# Altium schematic sheet FPGA_MIO.SchDoc: TE0723 - FPGA MIO
size A4; PageSetup: Record=PageOptions|CenterHorizontal=True|CenterVertical=True|PrintScale=0.96|XCorrection=1.00|YCorrection=1.00|PrintKind=0|BorderSize=5000000|LeftOffset=0|BottomOffset=0|Orientation=2|PaperLength=1000|PaperWidth=1000|Scale=100|PaperSource=7|PrintQuality=-4|MediaType=1|DitherType=10|PaperKind=A4|PrintScaleMode=1; Organization: Trenz Electronic GmbH; DocumentNumber: TE0723; Revision: 01; SheetNumber: 4; SheetTotal: 12; Date: 08.07.2015; Author: Indrek Tubalkain; CompanyName: Trenz Electronic GmbH; DrawnBy: Indrek Tubalkain; Engineer: Indrek Tubalkain; ProjectName: TE0723 Arduino
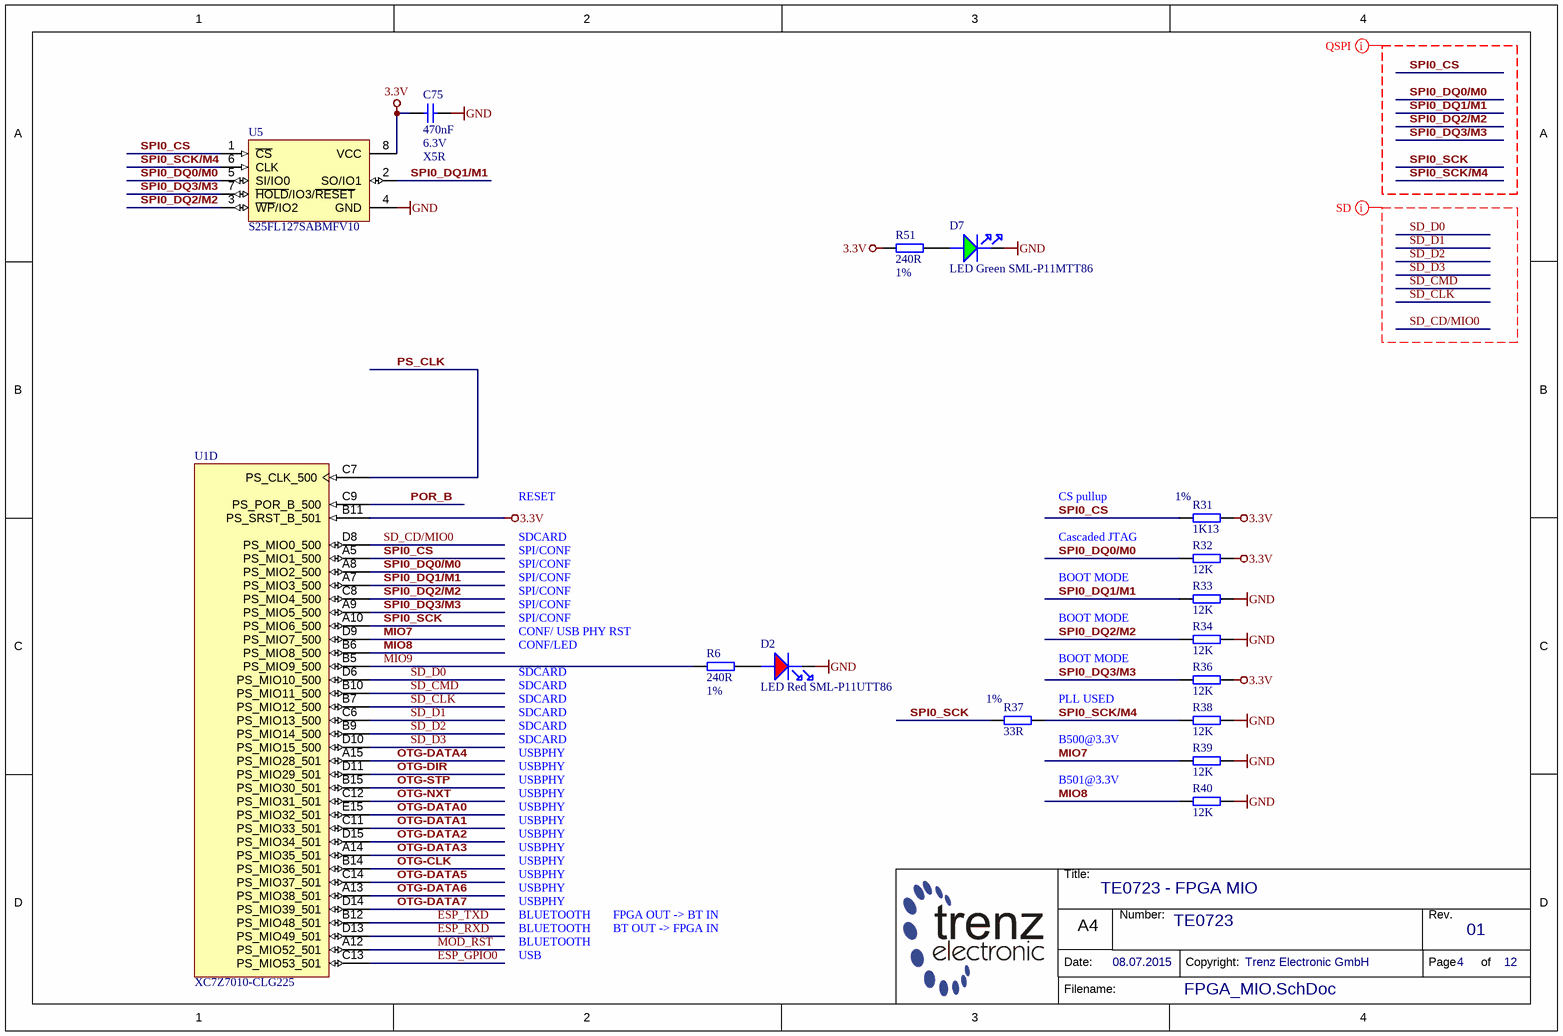
[diagram p0: FPGA_MIO.SchDoc]

## Parts
C75  470nF  Voltage: 6.3V  Technology: X5R  [CAPC0603X33N]
D2  LED Red SML-P11UTT86  [LEDC1006X25N_RED]
D7  LED Green SML-P11MTT86  [LEDC1006X25N_GREEN]
R6  240R  Tolerance: 1%  [RESC1005X40N]
R31  1K13  Tolerance: 1%  [RESC1005X40N]
R32  12K  [RESC1005X40N]
R33  12K  [RESC1005X40N]
R34  12K  [RESC1005X40N]
R36  12K  [RESC1005X40N]
R37  33R  Tolerance: 1%  [RESC0603X26N]
R38  12K  [RESC1005X40N]
R39  12K  [RESC1005X40N]
R40  12K  [RESC1005X40N]
R51  240R  Tolerance: 1%  [RESC1005X40N]
U1  XC7Z7010-CLG225  (part D of 8)
U5  S25FL127SABMFV10  [SOIC127P790X216-8N]

## Nets
3.3V: C75.1 R31.2 R32.2 R36.2 R51.2 U1.B11(PS_SRST_B_501) U5.8(VCC)
GND: C75.2 D2.K D7.K R33.2 R34.2 R38.2 R39.2 R40.2 U5.4(GND)
ESP_GPIO0: U1.C13(PS_MIO53_501)
ESP_RXD: U1.D13(PS_MIO49_501)
ESP_TXD: U1.B12(PS_MIO48_501)
MIO7: R39.1 U1.D9(PS_MIO7_500)
MIO8: R40.1 U1.B6(PS_MIO8_500)
MIO9: R6.2 U1.B5(PS_MIO9_500)
MOD_RST: U1.A12(PS_MIO52_501)
OTG-CLK: U1.B14(PS_MIO36_501)
OTG-DATA0: U1.E15(PS_MIO32_501)
OTG-DATA1: U1.C11(PS_MIO33_501)
OTG-DATA2: U1.D15(PS_MIO34_501)
OTG-DATA3: U1.A14(PS_MIO35_501)
OTG-DATA4: U1.A15(PS_MIO28_501)
OTG-DATA5: U1.C14(PS_MIO37_501)
OTG-DATA6: U1.A13(PS_MIO38_501)
OTG-DATA7: U1.D14(PS_MIO39_501)
OTG-DIR: U1.D11(PS_MIO29_501)
OTG-NXT: U1.C12(PS_MIO31_501)
OTG-STP: U1.B15(PS_MIO30_501)
POR_B: U1.C9(PS_POR_B_500)
PS_CLK: U1.C7(PS_CLK_500)
SD_CD/MIO0: U1.D8(PS_MIO0_500)
SD_CLK: U1.B7(PS_MIO12_500)
SD_CMD: U1.B10(PS_MIO11_500)
SD_D0: U1.D6(PS_MIO10_500)
SD_D1: U1.C6(PS_MIO13_500)
SD_D2: U1.B9(PS_MIO14_500)
SD_D3: U1.D10(PS_MIO15_500)
SPI0_CS: R31.1 U1.A5(PS_MIO1_500) U5.1(~{CS})
SPI0_DQ0/M0: R32.1 U1.A8(PS_MIO2_500) U5.5(SI/IO0)
SPI0_DQ1/M1: R33.1 U1.A7(PS_MIO3_500) U5.2(SO/IO1)
SPI0_DQ2/M2: R34.1 U1.C8(PS_MIO4_500) U5.3(~{WP}/IO2)
SPI0_DQ3/M3: R36.1 U1.A9(PS_MIO5_500) U5.7(~{HOLD}/IO3/~{RESET})
SPI0_SCK: R37.1 U1.A10(PS_MIO6_500)
SPI0_SCK/M4: R37.2 R38.1 U5.6(CLK)
NetD2_A: D2.A R6.1
NetD7_A: D7.A R51.1

## Layout directives
net class QSPI: SPI0_CS, SPI0_DQ0/M0, SPI0_DQ1/M1, SPI0_DQ2/M2, SPI0_DQ3/M3, SPI0_SCK, SPI0_SCK/M4
net class SD: SD_CD/MIO0, SD_CLK, SD_CMD, SD_D0, SD_D1, SD_D2, SD_D3

## Notes on the sheet
- RESET
- CS pullup
- SDCARD
- SPI/CONF
- Cascaded JTAG
- BOOT MODE
- CONF/LED
- CONF/ USB PHY RST
- (near R37) PLL USED
- USBPHY
- B501@3.3V
- (near R37) B500@3.3V
- BLUETOOTH
- FPGA OUT -> BT IN
- USB
- BT OUT -> FPGA IN
- Title:
- Number:
- Rev.
- Date:
- A4
- Copyright:
- Page
- of
- Filename:

## Library data of the parts
C75 = 24921: KON 470nF X5R 6.3V SMD 20%; AN: 24921; Value: 470n; Mixed: SMT; Preferred: Yes; Case: 0603 (0201); Tolerance: 20%
D2 = 24212: LED Rot SML-P11UTT86 SMD; AN: 24212; Mixed: SMT; Preferred: Yes; Case: 1005 (0402); HelpURL: B:\AD\adlib\datasheet\SML-P1
D7 = 24211: LED Grün SML-P11MTT86 SMD; AN: 24211; Mixed: SMT; Preferred: Yes; Case: 1005 (0402); HelpURL: B:\AD\adlib\datasheet\SML-P1
R6 R51 = 23661: WID SMD 240R 1% 0,063W; AN: 23661; Mixed: SMT; Value: 240; Preferred: Yes; Case: 1005 (0402)
R31 = 23160: WID SMD 1K13 1% 0,063W; AN: 23160; Mixed: SMT; Value: 1.13K; Preferred: Yes; Case: 1005 (0402)
R32-R34 R36 R38-R40 = 22598: WID SMD 12K 1% 0,063W; AN: 22598; Mixed: SMT; Preferred: Yes; Case: 1005 (0402); Value: 12K
R37 = 25021: WID SMD 33R 1% 0,05W; AN: 25021; Value: 33; Mixed: SMT; Preferred: Yes; Case: 0603 (0201); HelpURL: B:\AD\adlib\datasheet\R0201
U5 = 26078: S25FL127SABMFV10 automotive SO8; AN: 26078; Mixed: SMT; Case: SO8W; HelpURL: B:\AD\adlib\datasheet\S25FL12xS